# EasyEDA Pro project 2.4G8通道发射板1代.epro

# Schematic 2.4G8通道发射板
Create Date: 2023-11-30; Page Name: P1; Project Name: 遥控小车驱动小板; Schematic Name: 2.4G8通道发射板; Update Date: 2023-12-01; Company: 嘉立创EDA; Page Size: A4; Version: V1.0
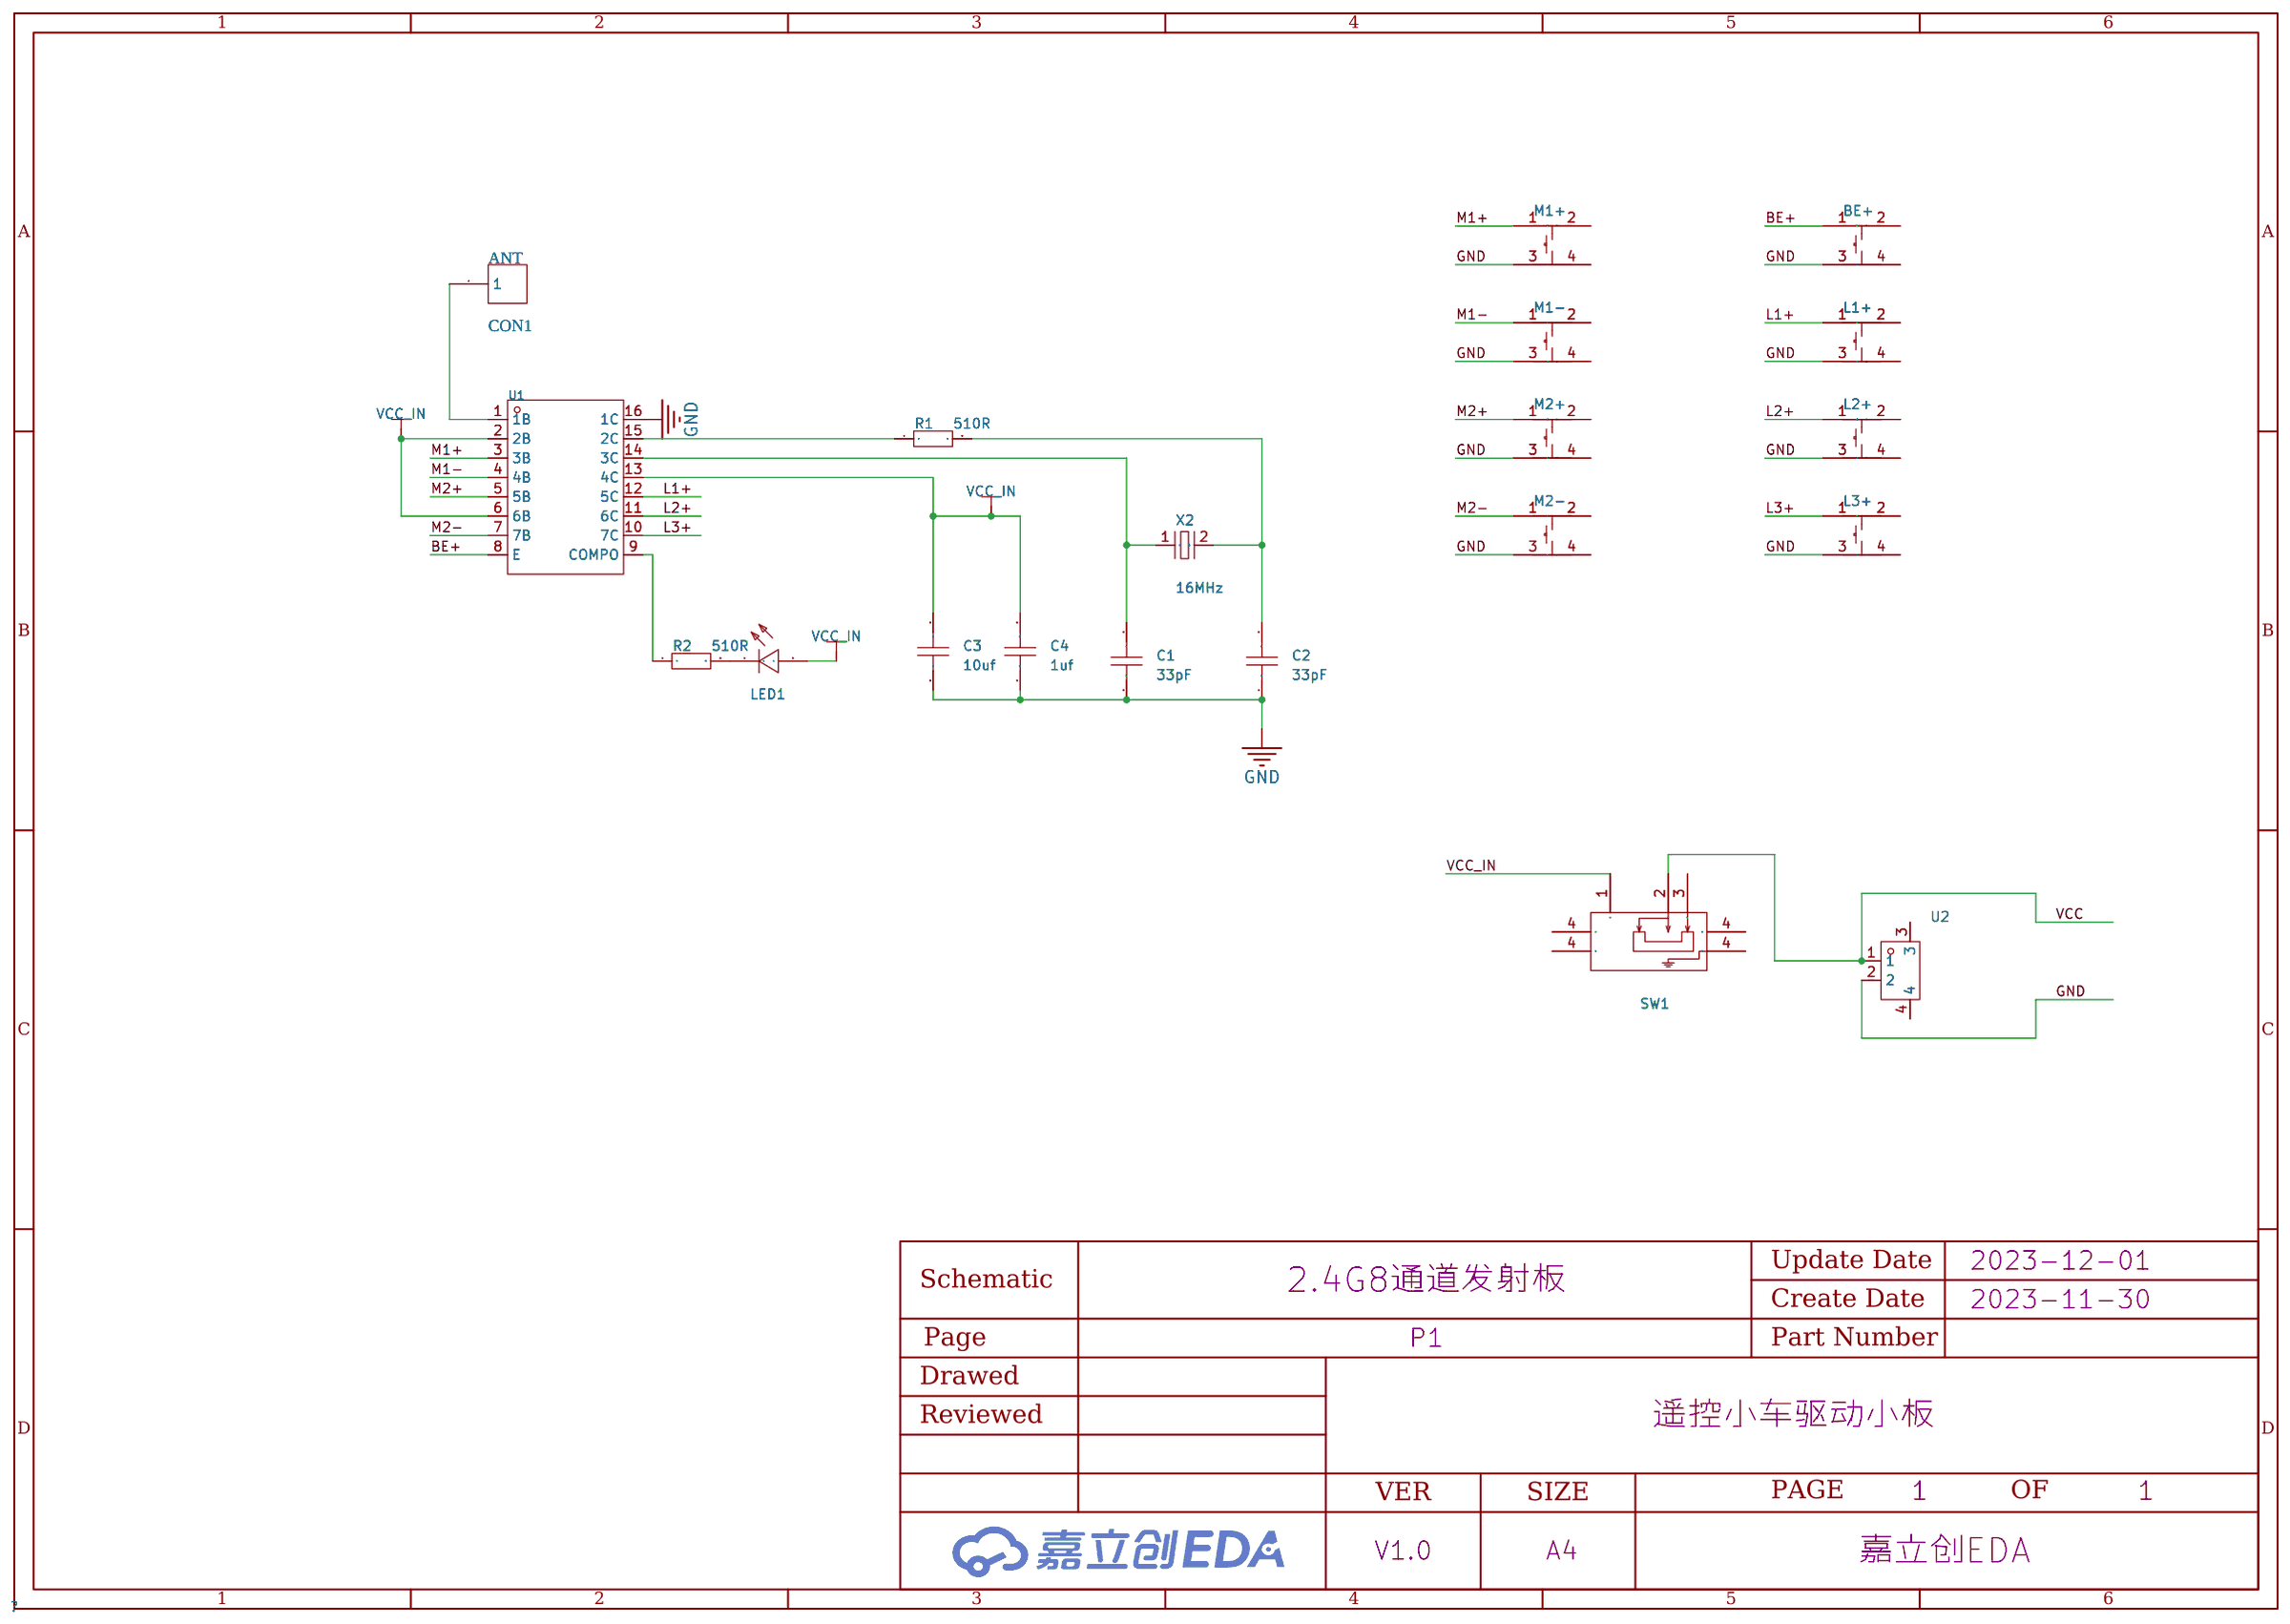
[diagram p0: schematic sheet]

## Parts
ANT  CON1  [CON1_2]
BE+  TS-1095S-A1B3-C2D1  [SW-SMD_4P-L6.0-W6.0-P4.50-LS8.5]
C1  33pF  [C0603]
C2  33pF  [C0603]
C3  10uf  [C0603]
C4  1uf  [C0603]
L1+  TS-1095S-A1B3-C2D1  [SW-SMD_4P-L6.0-W6.0-P4.50-LS8.5]
L2+  TS-1095S-A1B3-C2D1  [SW-SMD_4P-L6.0-W6.0-P4.50-LS8.5]
L3+  TS-1095S-A1B3-C2D1  [SW-SMD_4P-L6.0-W6.0-P4.50-LS8.5]
LED1  NCD0603R1  [LED0603-RD_RED]
M1+  TS-1095S-A1B3-C2D1  [SW-SMD_4P-L6.0-W6.0-P4.50-LS8.5]
M1-  TS-1095S-A1B3-C2D1  [SW-SMD_4P-L6.0-W6.0-P4.50-LS8.5]
M2+  TS-1095S-A1B3-C2D1  [SW-SMD_4P-L6.0-W6.0-P4.50-LS8.5]
M2-  TS-1095S-A1B3-C2D1  [SW-SMD_4P-L6.0-W6.0-P4.50-LS8.5]
R1  510R  [R0603]
R2  510R  [R0603]
SW1  MSK12C02  [SW-TH_MSK12C02]
U1  ULN2003A  [SOP-16_L10.0-W3.9-P1.27-LS6.0-BL]
U2  XD-GH-2PWT  [CONN-SMD_GH-2PWT]
X2  16MHz  [CRYSTAL-TH_BD3.0-P1.10-D0.4]

## Library data of the parts
ANT = CON1: Library Name: 杰梗原理图库
BE+ L1+ L2+ L3+ M1+ M1- M2+ M2- = TS-1095S-A1B3-C2D1: 电路结构:单刀单掷;按钮作用方向:顶部触动;致动器样式:圆形按钮;照明颜色:-;作用力:250gf ±30gf;开关长度:6mm;开关宽度:6mm;开关高度:4.3mm;; LCSC Part Name: 轻触开关6*6*4.3mm贴片四脚SMD黑柄250gf; Supplier Part: C493061; Manufacturer: Yuandi(元迪); JLCPCB Part Class: 扩展库; Datasheet: https://atta.szlcsc.com/upload/public/pdf/source/20200316/C493020_660A0B796DFD577DFFC16EBBCF440F36.pdf; Supplier: LCSC; Circuit: 单刀单掷; Actuator Orientation: 顶部触动; Actuator Style: 圆形按钮; Operating Force: 250gf ±30gf; Switch Length: 6mm; Switch Width: 6mm; Switch Height: 4.3mm
C1-C4 = CAP_0603: Supplier Footprint: 0603
LED1 = NCD0603R1_C84263: 发光颜色:红色;功率:65mW;透镜颜色:无色透明;主波长:615nm~630nm;发光强度:80mcd~220mcd;发光角度:130°;工作温度:-30℃~+85℃;; LCSC Part Name: 红灯 0603红灯   正贴; Supplier Part: C84263; Manufacturer: 国星光电; Supplier Footprint: 0603; JLCPCB Part Class: 扩展库; Datasheet: https://atta.szlcsc.com/upload/public/pdf/source/20200820/C84263_DABC6A75E58F576973B407FDBA283D60.pdf; Supplier: LCSC; Emitted Color: 红色; Forward Voltage (VF): 1.6V~2.6V; Forward Current: 20mA; Power Dissipation: 65mW; Lens Color: 无色透明; Dominant Wavelength: 615nm~630nm; Luminous Intensity: 80mcd~220mcd; Viewing Angle: 130°; Operating Temperature: -30℃~+85℃
R1 R2 = Res_0603: Supplier Footprint: 0603
SW1 = MSK12C02: LCSC Part Name: 两档侧拨贴片 7脚 拨动 白柄 柄长1.5mm,带定位柱; Supplier Part: C431540; Manufacturer: SHOU HAN(首韩); Supplier Footprint: SMD; JLCPCB Part Class: Extended Part; Datasheet: https://atta.szlcsc.com/upload/public/pdf/source/20190925/C431540_89155AEF0758B9AD1B2D805F83FB12E3.pdf; Supplier: LCSC
U1 = ULN2003A_C482013: 开态输入电压(VI(on)@Vce,Ic):3V@2V,300mA;集射极饱和压降(VCE(sat)@Ii,Ic):900mV;开态输入电流(Ii@Vi):930uA@3.85V;; Supplier Part: C482013; Manufacturer: UMW(友台半导体); Supplier Footprint: SOP-16; JLCPCB Part Class: 扩展库; Datasheet: https://atta.szlcsc.com/upload/public/pdf/source/20210729/C482013_EA98BD063A0F1E79EB7301A16A5D0011.pdf; Supplier: LCSC; ON-state input   voltage(VI(on)@Vce,Ic): 3V@2V,300mA; Collector-emitter   saturation voltage (VCE(sat)@Ii,Ic): 900mV; Output leakage current (Icex@Vce): 20uA@50V; Input current (Ii@Vi): 930uA@3.85V; Off-state input current (Ii(off)@Vce,Ic): 100uA@500uA; Clamp Diode Leakage Current (IR@VR): 5uA@50V; Clamp Diode Forward Voltage (VF@IF): 1.7V@350mA; Input Capacitance (Ci): 15pF; Operating Temperature: -40℃~+85℃
U2 = XD-GH-2PWT: 参考系列:GH;间距:1.25mm;插针结构:1x2P;排数:1;每排PIN数:2;公母:公型插针;安装方式:卧贴;额定电流:1A;触头镀层:锡;工作温度范围:-40℃~+105℃;; LCSC Part Name: 间距:1.25mm 1x2P 卧贴 带扣 线对板/线对线连接器; Supplier Part: C17700380; Manufacturer: XUNDA(讯答); Supplier Footprint: SMD,P=1.25mm; Datasheet: https://atta.szlcsc.com/upload/public/pdf/source/20231019/0574E105206498063B39A8D5088E5395.pdf; Supplier: LCSC; Reference Series: GH; Pitch: 1.25mm; Pins Structure: 1x2P; Number of Rows: 1; Number of PINs Per Row: 2; Gender: 公型插针; Mounting Style: 卧贴; Current Rating (Max): 1A; Contact Plating: 锡; Operating Temperature Range: -40℃~+105℃
X2 = Q3816000ZWFAC: 频率:16MHz;频率公差:±20ppm;负载电容:20pF;; LCSC Part Name: 16MHz ±20ppm 20pF; Supplier Part: C2686281; Manufacturer: JYJE(晶友嘉); Supplier Footprint: DT-38; JLCPCB Part Class: Extended Part; Datasheet: https://atta.szlcsc.com/upload/public/pdf/source/20210125/C2686274_6F24C78119C1F58B7C4228EDB3C8DB66.pdf; Supplier: LCSC; Crystal Type: 直插无源晶振; Frequency Tolerance: ±20ppm; Frequency Stability: ±30ppm; Load Capacitance: 20pF; Equivalent Series Resistance (ESR): 60Ω; Operating Temperature: -40℃~+85℃

## Nets
GND: BE+.3 C1.1 C2.1 C3.1 C4.1 L1+.3 L2+.3 L3+.3 M1+.3 M1-.3 M2+.3 M2-.3 U1.16(1C) U2.2
VCC: SW1.2 U2.1
VCC_IN: C3.2 C4.2 LED1.2(A) SW1.1 U1.2(2B) U1.6(6B) U1.13(4C)
BE+: BE+.1 U1.8(E)
L1+: L1+.1 U1.12(5C)
L2+: L2+.1 U1.11(6C)
L3+: L3+.1 U1.10(7C)
M1+: M1+.1 U1.3(3B)
M1-: M1-.1 U1.4(4B)
M2+: M2+.1 U1.5(5B)
M2-: M2-.1 U1.7(7B)
$1N1074: LED1.1(K) R2.2
Net-(ANT-1): ANT.1 U1.1(1B)
Net-(C1-2): C1.2 U1.14(3C) X2.1
Net-(C2-2): C2.2 R1.2 X2.2(GND)
Net-(R1-1): R1.1 U1.15(2C)
Net-(R2-1): R2.1 U1.9(COMPO)

Not connected (* = marked no-connect by the designer): BE+ 2 4; L1+ 2 4; L2+ 2 4; L3+ 2 4; M1+ 2 4; M1- 2 4; M2+ 2 4; M2- 2 4; SW1 3 4; U2 3 4

# Board 2.4G8通道发射板
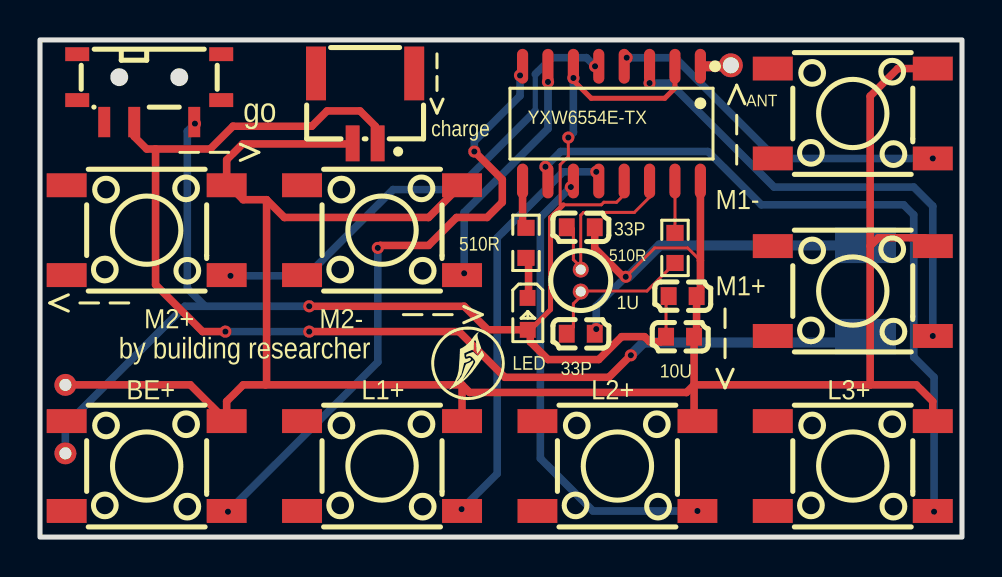
[diagram p1: board, top side]
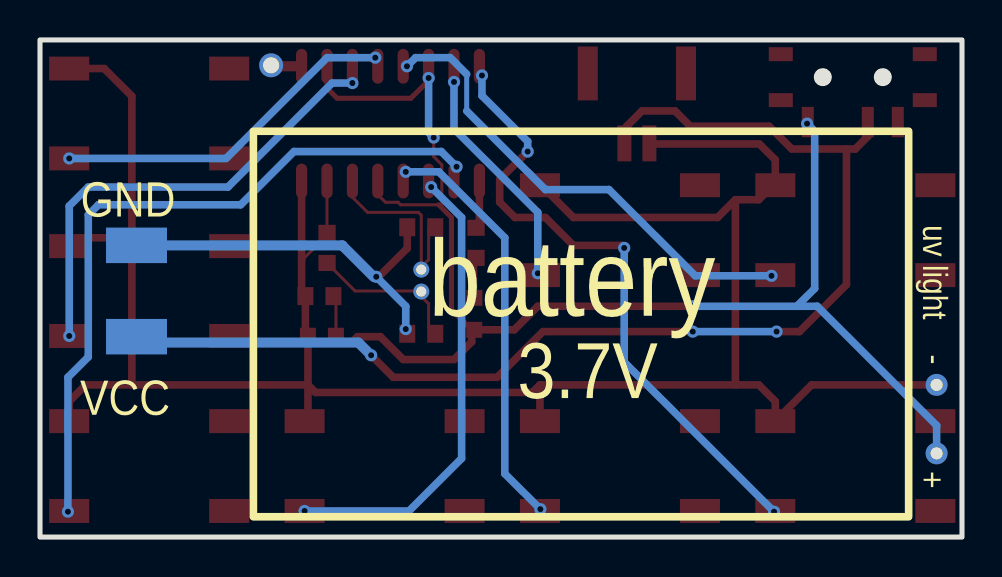
[diagram p2: board, bottom side, seen from below]

Outline 46.1 x 24.89 mm; copper layers: Top Layer, Bottom Layer. Coordinates in mm from the lower left corner of the outline.
Outline path: rectangle 46.1,0 0,24.89
Stack: Top Layer 0.035mm / Dielectric1 1.51mm FR4 er 4.5 / Bottom Layer 0.035mm

## Design rules (mm)
template: JLCPCB Capability(Two Layers Board)
spacing copperThickness1oz (default): track to track 0.102, other pairs 0.152 to 0.3
spacing copperThickness2oz: track to track 0.203, other pairs 0.152 to 0.3
track width copperThickness1oz (default): min 0.127, default 0.254, max 2.54
track width copperThickness2oz: min 0.203, default 0.254, max 2.54
differential pair differentialPair (default): width min 0.127, default 0.254, max 2.54; gap min 0.152, default 0.152
via viaSize (default): diameter min 0.5, default 0.61, max 10; hole min 0.3, default 0.305, max 6.3

## Placement (name value [footprint] x y rotation side)
1U  1uf  [C0603]  32.13 12.06 180 top
10U  10uf  [C0603]  32 10.03 180 top
33P  -  [C0603]  27.04 10.18 180 top
33P#2  -  [C0603]  27.04 15.51 180 top
510R  510R  [R0603]  31.75 14.48 270 top
ANT  CON1  [con1_2]  34.54 23.62 180 top
BE+  TS-1095S-A1B3-C2D1  [SW-SMD_4P-L6.0-W6.0-P4.50-LS8.5]  5.33 3.56 180 top
C  XD-GH-2PWT  [CONN-SMD_GH-2PWT]  16.26 21.46 180 top
L1+  TS-1095S-A1B3-C2D1  [SW-SMD_4P-L6.0-W6.0-P4.50-LS8.5]  17.1 3.56 180 top
L2+  TS-1095S-A1B3-C2D1  [SW-SMD_4P-L6.0-W6.0-P4.50-LS8.5]  28.87 3.56 180 top
L3+  TS-1095S-A1B3-C2D1  [SW-SMD_4P-L6.0-W6.0-P4.50-LS8.5]  40.64 3.56 180 top
LED1  NCD0603R1  [LED0603-RD_RED]  24.38 11.18 270 top
M1+  TS-1095S-A1B3-C2D1  [SW-SMD_4P-L6.0-W6.0-P4.50-LS8.5]  40.64 12.32 180 top
M1-  TS-1095S-A1B3-C2D1  [SW-SMD_4P-L6.0-W6.0-P4.50-LS8.5]  40.64 21.21 180 top
M2+  TS-1095S-A1B3-C2D1  [SW-SMD_4P-L6.0-W6.0-P4.50-LS8.5]  5.33 15.37 180 top
M2-  TS-1095S-A1B3-C2D1  [SW-SMD_4P-L6.0-W6.0-P4.50-LS8.5]  17.1 15.37 180 top
NOREF  -  [Pad_e302]  41.27 14.61 0 top
NOREF#2  -  [Pad_e10]  1.27 7.62 0 top
NOREF#3  -  [Pad_e307]  41.27 10.03 0 top
NOREF#4  -  [Pad_e12]  1.27 4.19 0 top
R2  510R  [R0603]  24.3 14.73 270 top
SW1  MSK12C02  [SW-TH_MSK12C02]  5.46 22.48 180 top
X2  16MHz  [CRYSTAL-TH_BD3.0-P1.10-D0.4]  27.04 12.84 270 top
YXW6554E-TX  ULN2003A  [SOP-16_L10.0-W3.9-P1.27-LS6.0-BL]  28.57 20.7 180 top

## Footprints (pads in the part's own frame, mm; a bottom-side part is the same pattern mirrored in y, then rotated)
C0603
  rect 0.8x0.9 smd: 1(-0.7,0) 2(0.7,0)
con1_2
  round 1.2 hole 0.8: 1(0,0)
CONN-SMD_GH-2PWT
  rect 0.7x1.8 smd: 1(-0.625,1.75) 2(0.625,1.75)
  rect 1x2.7 smd: 3(-2.455,-1.75) 4(2.455,-1.75)
CRYSTAL-TH_BD3.0-P1.10-D0.4
  round 0.8 hole 0.5: 1(-0.55,0) 2(0.55,0)
LED0603-RD_RED
  rect 0.8x0.8 smd: 1(-0.799,-0.004) 2(0.799,0.004)
Pad_e10
  round 1.1 hole 0.6: 18(0,0)
Pad_e12
  round 1.1 hole 0.6: 18(0,0)
Pad_e302
  rect 3.048x1.778 smd far side: 17(0,0)
Pad_e307
  rect 3.048x1.778 smd far side: 17(0,0)
R0603
  rect 0.806x0.864 smd: 1(-0.753,0) 2(0.753,0)
SOP-16_L10.0-W3.9-P1.27-LS6.0-BL
  oval 0.56x1.745 smd: 1(-4.445,-2.873) 2(-3.175,-2.873) 3(-1.905,-2.873) 4(-0.635,-2.873) 5(0.635,-2.873) 6(1.905,-2.873) 7(3.175,-2.873) 8(4.445,-2.873) 9(4.445,2.873) 10(3.175,2.873) 11(1.905,2.873) 12(0.635,2.873) 13(-0.635,2.873) 14(-1.905,2.873) 15(-3.175,2.873) 16(-4.445,2.873)
SW-SMD_4P-L6.0-W6.0-P4.50-LS8.5
  rect 2x1.2 smd: 1(-4,2.25) 2(4,2.25) 3(-4,-2.25) 4(4,-2.25)
SW-TH_MSK12C02
  rect 0.6x1.524 smd: 1(-2.25,1.7) 2(0.75,1.7) 3(2.25,1.7)
  rect 1.2x0.7 smd: 4(-3.6,0.6) 4(-3.6,-1.7) 4(3.6,0.6) 4(3.6,-1.7)

## Nets
GND: 1U.1 10U.1 33P.1 33P#2.1 BE+.3 C.2 L1+.3 L2+.3 L3+.3 M1+.3 M1-.3 M2+.3 M2-.3 NOREF.17 NOREF#2.18 YXW6554E-TX.16
VCC: C.1 NOREF#3.17 SW1.2
VCC_IN: 1U.2 10U.2 LED1.2 NOREF#4.18 SW1.1 YXW6554E-TX.2 YXW6554E-TX.6 YXW6554E-TX.13
BE+: BE+.1 YXW6554E-TX.8
L1+: L1+.1 YXW6554E-TX.12
L2+: L2+.1 YXW6554E-TX.11
L3+: L3+.1 YXW6554E-TX.10
M1+: M1+.1 YXW6554E-TX.3
M1-: M1-.1 YXW6554E-TX.4
M2+: M2+.1 YXW6554E-TX.5
M2-: M2-.1 YXW6554E-TX.7
$1N661: 33P.2 510R.2 X2.2
$1N667: 510R.1 YXW6554E-TX.15
$1N672: 33P#2.2 X2.1 YXW6554E-TX.14
$1N923: ANT.1 YXW6554E-TX.1
$1N1074: LED1.1 R2.2
$1N1154: R2.1 YXW6554E-TX.9

Pads without a net: BE+ 2 4; C 3 4; L1+ 2 4; L2+ 2 4; L3+ 2 4; M1+ 2 4; M1- 2 4; M2+ 2 4; M2- 2 4; SW1 3 4

## Via types
v1: diameter 0.61, hole 0.305, Top Layer to Bottom Layer, 27 vias

## Routing (per net, layer and track width the routed paths; a pad name or vN(x,y) marks a point on that pad's centre or on a via; arc(x,y) is an arc through that point)
GND: length 137.8
  Top Layer w0.152: 33.02,13.85 33.01,13.85 32.38,14.48 30.73,14.48 29.23,12.97
  Top Layer w0.381: 41.51,14.57 41.51,7.62 ; 41.51,14.57 41.92,14.99 44.22,14.99 M1+.3 ; 41.51,14.57 41.51,22.08 42.89,23.46 M1-.3 ; 41.51,7.62 43.81,7.62 44.64,6.8 L3+.3 ; 41.51,7.62 32.7,7.62 ; 11.33,16.89 11.33,7.67 11.28,7.62 ; 11.33,16.89 12.22,16 19.43,16 21.4,17.97 21.4,17.62 ; 11.33,16.89 10.16,16.89 9.33,17.72 9.33,18.89 10.13,19.69 15.6,19.69 C.2 ; 11.28,7.62 10.16,7.62 9.33,6.79 BE+.3 7.52,7.62 NOREF#2.18 ; 11.28,7.62 21.1,7.62 ; 32.7,7.62 32.7,5.81 L2+.3 ; 32.7,7.62 32.32,7.24 21.48,7.24 21.1,7.62 ; 32.7,7.62 10U.1 32.83,10.16 1U.1 33.02,12.25 YXW6554E-TX.16 ; L1+.3 21.1,7.62 ; 29.23,12.97 27.74,14.46 27.74,15.64
  Bottom Layer w0.381: 29.42,13.03 v1(29.29,13.03) 27.81,11.56 v1(27.81,10.41)
  Bottom Layer w0.508: NOREF.17 30.99,14.61 29.42,13.03
VCC: length 60.1
  Top Layer w0.381: v1(9.27,10.29) 8.13,10.29 5.78,12.64 5.78,19.43 ; 5.78,19.43 8.51,19.43 9.65,20.57 13.59,20.57 14.35,21.34 16,21.34 16.76,20.57 16.76,19.83 C.1 ; 5.78,19.43 5.33,19.43 4.71,20.05 SW1.2 ; v1(29.54,9.1) 28.44,8 23.24,8 20.95,10.29 v1(13.46,10.29)
  Bottom Layer w0.381: v1(13.46,10.29) v1(9.27,10.29)
  Bottom Layer w0.508: NOREF#3.17 40.98,9.74 30.18,9.74 v1(29.54,9.1)
VCC_IN: length 72.9
  Top Layer w0.152: v1(26.42,20) 26.42,19.05 26.01,18.64 26.01,16.64 28.07,16.64 28.19,16.76 28.83,16.76 29.21,17.14 YXW6554E-TX.13 ; 26.67,23.37 YXW6554E-TX.6 ; 10U.2 31.3,11.94 1U.2
  Top Layer w0.254: 26.16,16.64 25.53,16 25.53,11.39 24.51,10.38 ; 26.67,23.37 v1(26.67,22.99) 26.67,22.86 27.56,21.97 31.24,21.97 31.75,22.48 YXW6554E-TX.2
  Top Layer w0.381: v1(13.46,11.56) 21.21,11.56 22.39,10.38 LED1.2 24.51,10.38 24.51,9.78 25.4,8.89 27.94,8.89 29.08,10.03 30.23,10.03 30.48,9.78 31.05,9.78 10U.2
  Bottom Layer w0.381: 8.25,11.56 7.37,12.45 7.37,20.32 v1(7.75,20.7) ; 8.25,11.56 v1(13.46,11.56) ; 8.25,11.56 7.24,11.56 1.27,5.59 NOREF#4.18 ; v1(26.67,22.99) 26.67,20.26 v1(26.42,20)
BE+: length 31.4
  Top Layer w0.381: v1(16.89,14.48) 17.02,14.61 19.43,14.61 20.83,16 22.35,16 23.11,16.76 23.11,17.91 v1(21.72,19.3)
  Bottom Layer w0.381: v1(21.72,19.3) 21.72,19.81 24,22.1 v1(24,23.11) ; v1(16.89,14.48) 16.89,8.76 v1(9.4,1.27)
L1+: length 20.6
  Bottom Layer w0.381: v1(27.81,18.29) 26.16,18.29 22.86,14.99 22.86,3.17 v1(21.08,1.4)
L2+: length 23.2
  Bottom Layer w0.381: v1(26.54,17.53) 25.02,16 25.02,3.94 27.65,1.31 v1(32.87,1.31)
L3+: length 35.3
  Bottom Layer w0.381: v1(25.27,18.54) 26.03,19.3 33.4,19.3 36.07,16.64 43.18,16.64 43.69,16.13 43.69,9.02 44.7,8 v1(44.7,1.27)
M1+: length 23.2
  Bottom Layer w0.381: v1(44.64,10.07) 44.64,16.57 43.69,17.53 36.7,17.53 31.5,22.73 v1(30.48,22.73)
M1-: length 17.4
  Bottom Layer w0.381: v1(29.34,24) 31.75,24 36.79,18.96 v1(44.64,18.96)
M2+: length 24
  Bottom Layer w0.254: 24.76,23.18 24.76,21.34
  Bottom Layer w0.381: v1(9.52,13.08) 13.33,13.08 17.65,17.4 20.83,17.4 24.76,21.34 ; v1(27.75,23.57) 27.32,24.01 25.59,24.01 24.76,23.18
M2-: length 11.5
  Bottom Layer w0.152: 25.4,22.99 v1(25.4,22.79)
  Bottom Layer w0.381: v1(25.4,22.79) 25.4,20.45 21.21,16.26 v1(21.21,13.21)
$1N661: length 7.7
  Top Layer w0.152: 510R.2 30.34,12.32 27.14,12.32 27.04,12.42 ; 33P.2 26.67,10.51 26.67,11.68 27.04,12.05 X2.2
$1N667: length 2.6
  Top Layer w0.152: 510R.1 YXW6554E-TX.15
$1N672: length 9.6
  Top Layer w0.152: 26.46,15.64 26.67,15.43 26.67,13.89 27.04,13.52 27.04,16.12 27.18,16.26 29.72,16.26 30.48,17.02 YXW6554E-TX.14
$1N923: length 1.5
  Top Layer w0.508: YXW6554E-TX.1 34.5,23.57 ANT.1
$1N1074: length 2
  Top Layer w0.381: 24.51,11.98 24.43,12.06 24.43,13.98
$1N1154: length 2.5
  Top Layer w0.381: 24.43,15.49 24.13,15.78 YXW6554E-TX.9

## Text on the board
Bottom Silkscreen Layer: uv light | - | + | GND | VCC | 3.7V | battery
Top Silkscreen Layer: --> | 510R | LED | charge | by building researcher | go
